# EAGLE design dlp.vco.dualosc.v1.1.main (EAGLE 7.2.0)
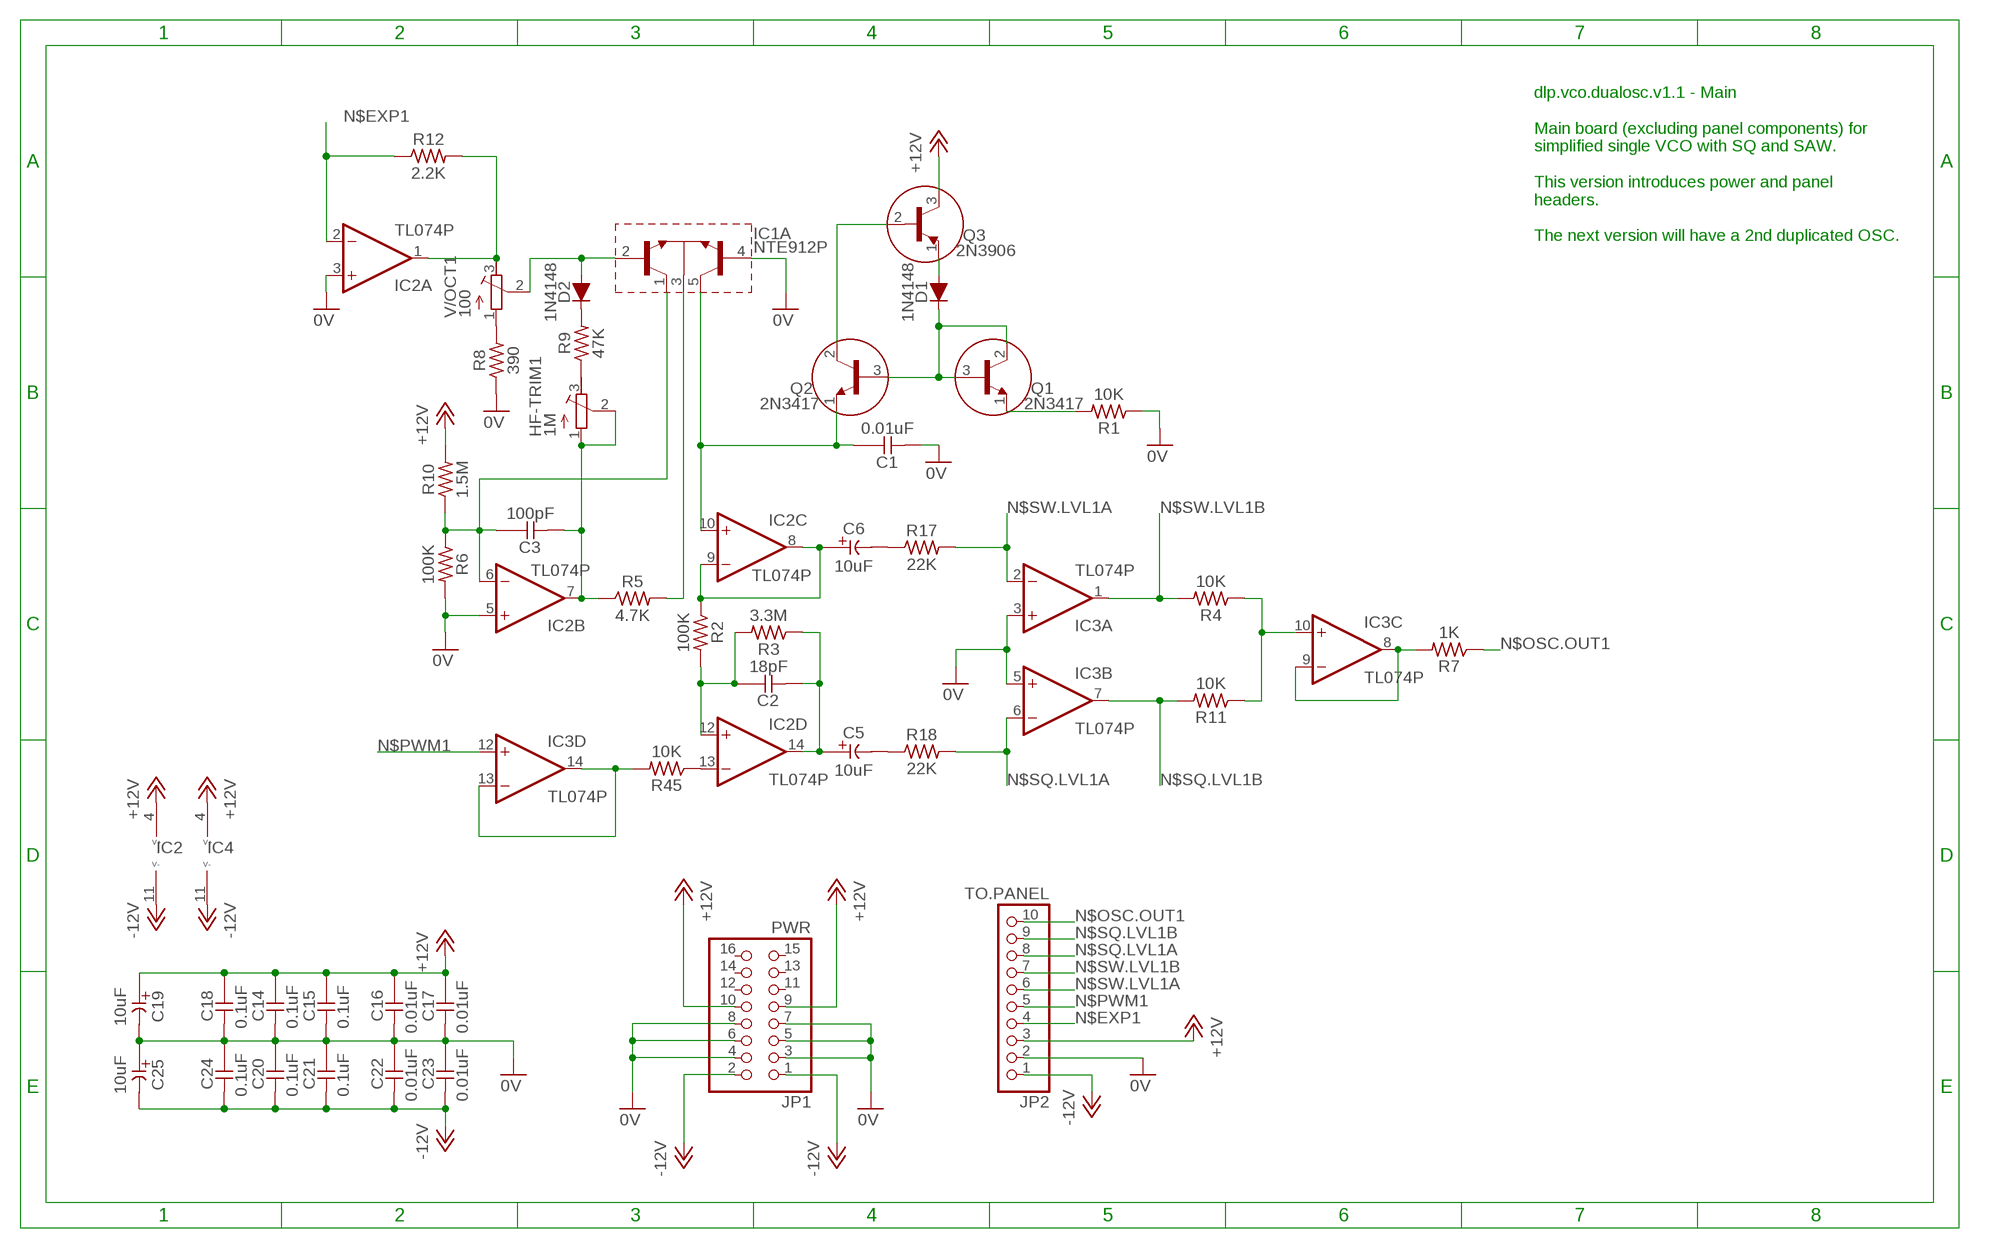
[diagram p0: schematic, sheet 1]

## Parts
C1  0.01uF  CC-US025-024X044  [C025-024X044]
C2  18pF  CC-US025-024X044  [C025-024X044]
C3  100pF  CC-US025-024X044  [C025-024X044]
C5  10uF  CE-USE2-5  [E2-5]
C6  10uF  CE-USE2-5  [E2-5]
C14  0.1uF  CC-US025-024X044  [C025-024X044]
C15  0.1uF  CC-US025-024X044  [C025-024X044]
C16  0.01uF  CC-US025-024X044  [C025-024X044]
C17  0.01uF  CC-US025-024X044  [C025-024X044]
C18  0.1uF  CC-US025-024X044  [C025-024X044]
C19  10uF  CE-USE2-5  [E2-5]
C20  0.1uF  CC-US025-024X044  [C025-024X044]
C21  0.1uF  CC-US025-024X044  [C025-024X044]
C22  0.01uF  CC-US025-024X044  [C025-024X044]
C23  0.01uF  CC-US025-024X044  [C025-024X044]
C24  0.1uF  CC-US025-024X044  [C025-024X044]
C25  10uF  CE-USE2-5  [E2-5]
D1  1N4148  [DO35-7]
D2  1N4148  [DO35-7]
HF-TRIM1  1M  R-TRIMM3296Y  [RTRIM3296Y]
IC1  NTE912P  [DIL14]
IC2  TL074P  [DIL14]
IC3  TL074P  [DIL14]
JP1  PWR  PINHD-2X8  [2X08]
JP2  TO.PANEL  PINHD-1X10  [1X10]
Q1  2N3417  [TO92]
Q2  2N3417  [TO92]
Q3  2N3906  [TO92]
R1  10K  R0309/10  [0309/10]
R2  100K  R0309/10  [0309/10]
R3  3.3M  R0309/10  [0309/10]
R4  10K  R0309/10  [0309/10]
R5  4.7K  R0309/10  [0309/10]
R6  100K  R0309/10  [0309/10]
R7  1K  R0309/10  [0309/10]
R8  390  R0309/10  [0309/10]
R9  47K  R0309/10  [0309/10]
R10  1.5M  R0309/10  [0309/10]
R11  10K  R0309/10  [0309/10]
R12  2.2K  R0309/10  [0309/10]
R17  22K  R0309/10  [0309/10]
R18  22K  R0309/10  [0309/10]
R45  10K  R0309/10  [0309/10]
V/OCT1  100  R-TRIMM3296Y  [RTRIM3296Y]

## Nets
0V: C1.2 C14.2 C15.2 C16.2 C17.2 C18.2 C19.- C20.1 C21.1 C22.1 C23.1 C24.1 C25.+ IC1.4(A:B3) IC2.3(A:+IN) IC2.5(B:+IN) IC3.3(A:+IN) IC3.5(B:+IN) JP1.3 JP1.4 JP1.5 JP1.6 JP1.7 JP1.8 JP2.2 R1.1 R6.2 R8.1
+12V: C14.1 C15.1 C16.1 C17.1 C18.1 C19.+ IC2.4(P:V+) IC3.4(P:V+) JP1.9 JP1.10 JP2.3 Q3.3(C) R10.2
-12V: C20.2 C21.2 C22.2 C23.2 C24.2 C25.- IC2.11(P:V-) IC3.11(P:V-) JP1.1 JP1.2 JP2.1
N$1: C1.1 IC1.5(A:C3) IC2.10(C:+IN) Q2.1(E)
N$2: Q2.2(C) Q3.2(B)
N$3: D1.A Q3.1(E)
N$4: C6.+ IC2.8(C:OUT) IC2.9(C:-IN) R2.1
N$5: D1.C Q1.2(C) Q1.3(B) Q2.3(B)
N$6: Q1.1(E) R1.2
N$7: C2.1 IC2.12(D:+IN) R2.2 R3.2
N$8: IC2.13(D:-IN) R45.1
N$9: C2.2 C5.+ IC2.14(D:OUT) R3.1
N$10: D2.A IC1.2(A:B1) V/OCT1.2(S)
N$12: IC1.3(A:E) R5.2
N$13: D2.C R9.2
N$14: R8.2 V/OCT1.1(A)
N$15: C3.1 IC1.1(A:C1) IC2.6(B:-IN) R6.1 R10.1
N$16: IC2.1(A:OUT) R12.2 V/OCT1.3(E)
N$17: HF-TRIM1.3(E) R9.1
N$18: IC3.10(C:+IN) R4.1 R11.1
N$20: IC3.8(C:OUT) IC3.9(C:-IN) R7.2
N$27: IC3.13(D:-IN) IC3.14(D:OUT) R45.2
N$29: C6.- R17.1
N$30: C5.- R18.1
N$37: C3.2 HF-TRIM1.1(A) HF-TRIM1.2(S) IC2.7(B:OUT) R5.1
N$EXP1: IC2.2(A:-IN) JP2.4 R12.1
N$OSC.OUT1: JP2.10 R7.1
N$PWM1: IC3.12(D:+IN) JP2.5
N$SQ.LVL1A: IC3.6(B:-IN) JP2.8 R18.2
N$SQ.LVL1B: IC3.7(B:OUT) JP2.9 R11.2
N$SW.LVL1A: IC3.2(A:-IN) JP2.6 R17.2
N$SW.LVL1B: IC3.1(A:OUT) JP2.7 R4.2
Unconnected: IC1.6(B:B) IC1.7(B:E) IC1.8(B:C) IC1.9(C:B) IC1.10(C:E) IC1.11(C:C) IC1.12(D:B) IC1.13(D:E) IC1.14(D:C) JP1.11 JP1.12 JP1.13 JP1.14 JP1.15 JP1.16

## Notes on the sheet
- dlp.vco.dualosc.v1.1 - Main
  
  Main board (excluding panel components) for 
  simplified single VCO with SQ and SAW.
  
  This version introduces power and panel 
  headers.
  
  The next version will have a 2nd duplicated OSC.
- IC2 | IC4

## Library data of the parts
C1-C3 C14-C18 C20-C24 = _common:CC-US: CAPACITOR, US symbol
C5 C6 C19 C25 = _common:CE-US: ELECTROLYTIC CAPACITOR, US symbol
D1 D2 = _common:1N4148: DIODE high speed (Philips)
HF-TRIM1 V/OCT1 = rcl:R-TRIMM: Trimm resistor
IC1 = _common:NTE912: NPN TRANSISTOR ARRAY
IC2 IC3 = _common:TL074: OP AMP
JP1 = pinhead:PINHD-2X8: PIN HEADER
JP2 = pinhead:PINHD-1X10: PIN HEADER
Q1 Q2 = _common:2N3417: NPN Transistor
Q3 = _common:2N3906: PNP Transistor
R1-R12 R17 R18 R45 = _common:R: RESISTOR, US symbol

## Board
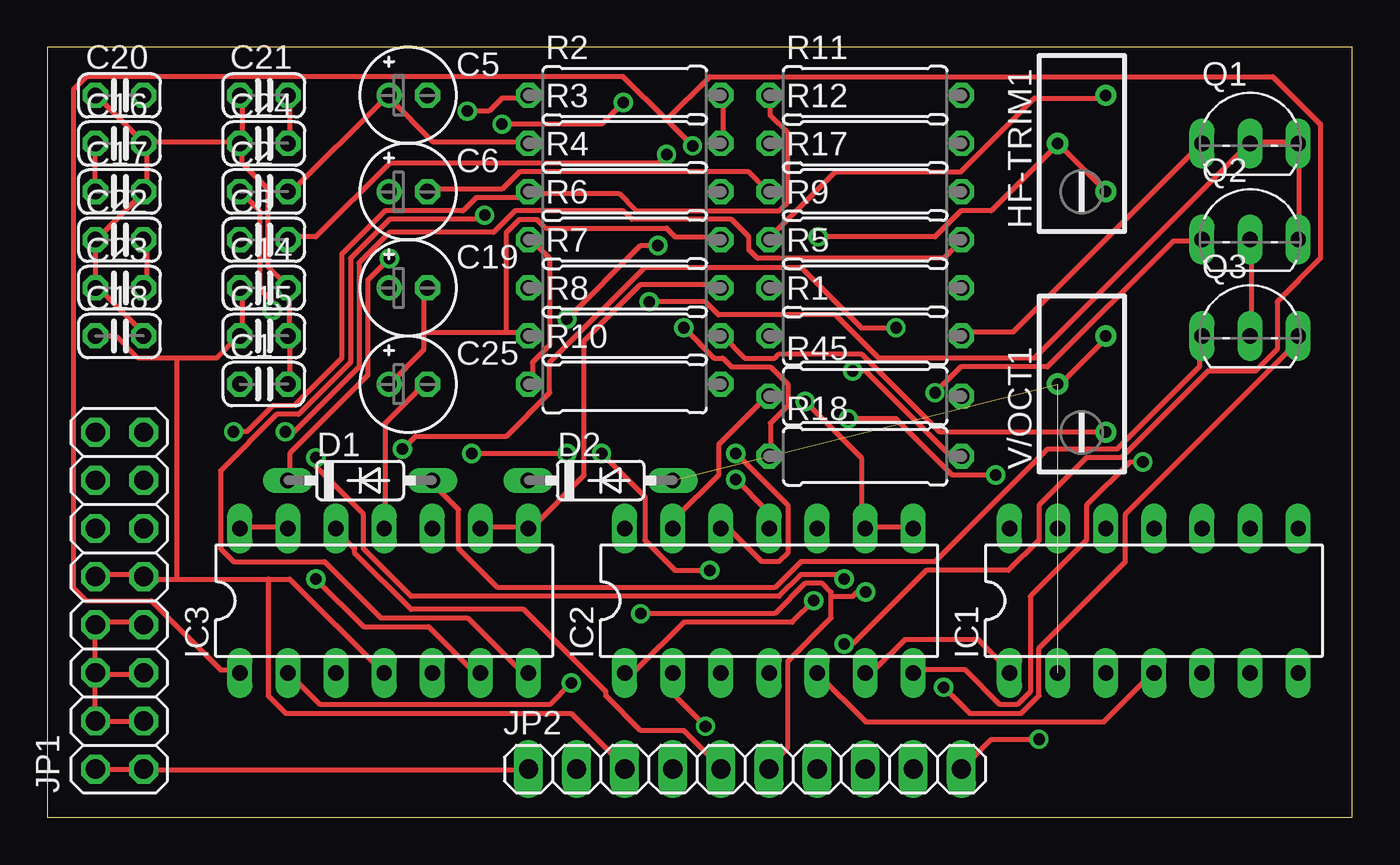
[diagram p1: board, top side]
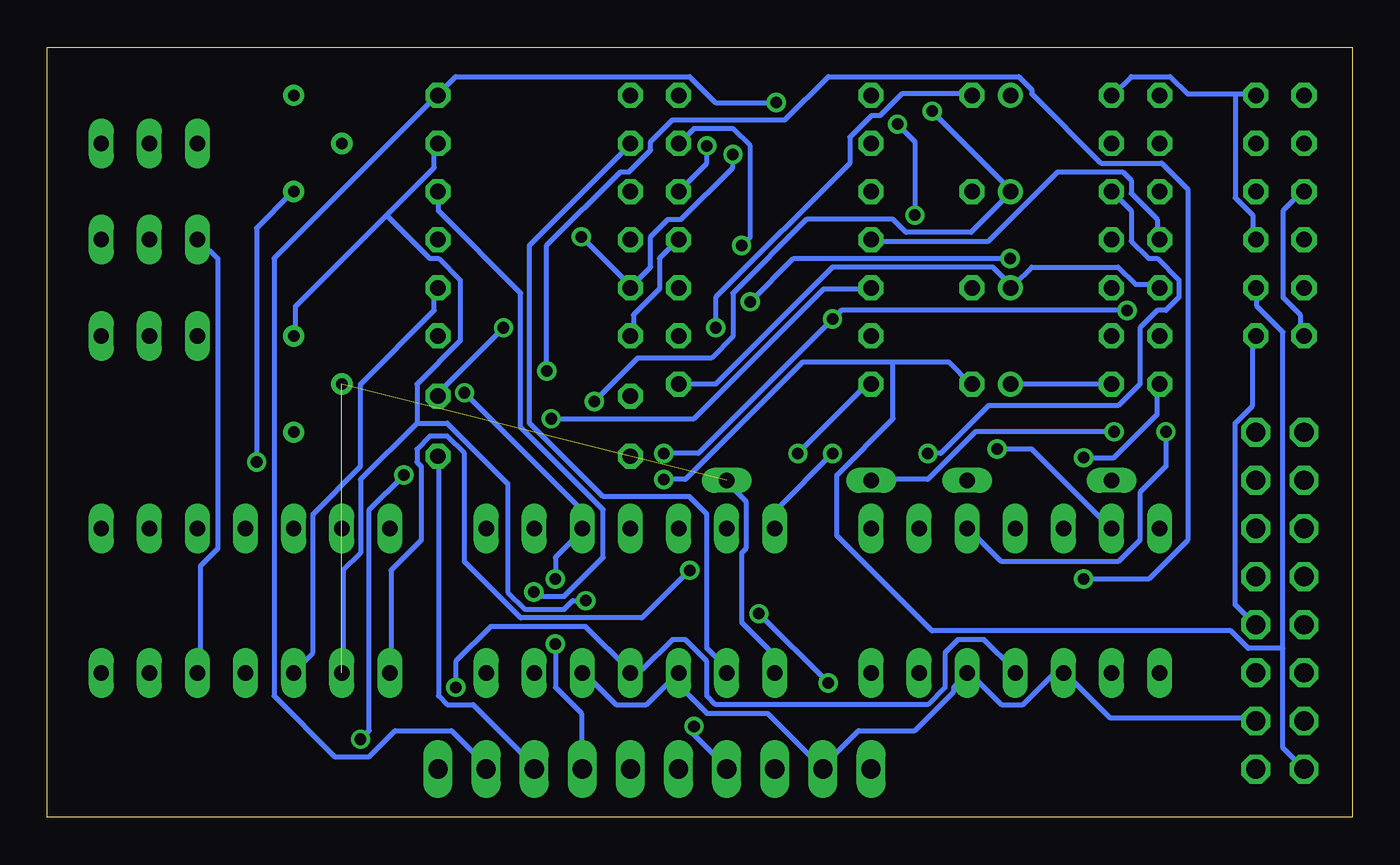
[diagram p2: board, bottom side, seen from below]

Size 68.89 x 40.63 mm. Coordinates in mm from the lower left corner, seen from the top.
Outline: 0,0 68.89,0 68.89,40.63 0,40.63 0,0
Copper layers (1*16): Top 0.035mm / dielectric 1.5mm / Bottom 0.035mm
Design rules "default": minimum track width 10mil, minimum drill 24mil, track to track 8mil, track to pad 8mil, pad to pad 8mil, via to via 8mil, smd to smd 8mil, copper to edge 40mil, drill to drill 8mil, minimum pad ring 10mil, minimum via ring 8mil, stop-mask expansion 4mil, vias tented up to drill 0mil, thermal gap 10mil

### Footprints (pad centres in the part's own frame; a part is rotated, then mirrored left to right if it is on the bottom)
C025-024X044 = drill 0.813 octagon: 1 -1.27,0; 2 1.27,0
E2-5 = drill 0.813 pad 1.27: + -1.016,0 | drill 0.813 pad 1.27 octagon: - 1.016,0
DO35-7 = drill 0.813 long: A 3.81,0; C -3.81,0
RTRIM3296Y = drill 0.61: 1 1.27,-2.54; 2 -1.27,0; 3 1.27,2.54
DIL14 = drill 0.813 long: 1 -7.62,-3.81; 2 -5.08,-3.81; 3 -2.54,-3.81; 4 0,-3.81; 5 2.54,-3.81; 6 5.08,-3.81; 7 7.62,-3.81; 8 7.62,3.81; 9 5.08,3.81; 10 2.54,3.81; 11 0,3.81; 12 -2.54,3.81; 13 -5.08,3.81; 14 -7.62,3.81
2X08 = drill 1.016 octagon: 1 -8.89,-1.27; 2 -8.89,1.27; 3 -6.35,-1.27; 4 -6.35,1.27; 5 -3.81,-1.27; 6 -3.81,1.27; 7 -1.27,-1.27; 8 -1.27,1.27; 9 1.27,-1.27; 10 1.27,1.27; 11 3.81,-1.27; 12 3.81,1.27; 13 6.35,-1.27; 14 6.35,1.27; 15 8.89,-1.27; 16 8.89,1.27
1X10 = drill 1.016 long: 1 -11.43,0; 2 -8.89,0; 3 -6.35,0; 4 -3.81,0; 5 -1.27,0; 6 1.27,0; 7 3.81,0; 8 6.35,0; 9 8.89,0; 10 11.43,0
TO92 = drill 0.813 long: 1 -2.54,-1.27; 2 0,-1.27; 3 2.54,-1.27
0309/10 = drill 0.813 octagon: 1 -5.08,0; 2 5.08,0

### Placement (x,y rotation side)
C1  11.43,22.86 0 top
C2  11.43,33.02 0 top
C3  11.43,30.48 0 top
C5  19.05,38.1 0 top
C6  19.05,33.02 0 top
C14  11.43,27.94 0 top
C15  11.43,25.4 0 top
C16  3.81,35.56 0 top
C17  3.81,33.02 0 top
C18  3.81,25.4 0 top
C19  19.05,27.94 0 top
C20  3.81,38.1 0 top
C21  11.43,38.1 0 top
C22  3.81,30.48 0 top
C23  3.81,27.94 0 top
C24  11.43,35.56 0 top
C25  19.05,22.86 0 top
D1  16.51,17.78 0 top
D2  29.21,17.78 0 top
HF-TRIM1  54.61,35.56 0 top
IC1  58.42,11.43 0 top
IC2  38.1,11.43 0 top
IC3  17.78,11.43 0 top
JP1  3.81,11.43 90 top
JP2  36.83,2.54 0 top
Q1  63.5,36.83 0 top
Q2  63.5,31.75 0 top
Q3  63.5,26.67 0 top
R1  43.18,25.4 0 top
R2  30.48,38.1 0 top
R3  30.48,35.56 0 top
R4  30.48,33.02 0 top
R5  43.18,27.94 0 top
R6  30.48,30.48 0 top
R7  30.48,27.94 0 top
R8  30.48,25.4 0 top
R9  43.18,30.48 0 top
R10  30.48,22.86 0 top
R11  43.18,38.1 0 top
R12  43.18,35.56 0 top
R17  43.18,33.02 0 top
R18  43.18,19.05 0 top
R45  43.18,22.23 0 top
V/OCT1  54.61,22.86 0 top

### Tracks (layer width: path | path; a pad name or v marks a point on that pad's centre or on a via)
0V
  Top 0.254: C18.2 5.03,25.6 2.74,27.89 C23.1 2.52,28.12 2.52,30.4 C22.1 2.74,30.63 5.03,32.92 C17.2 5.26,33.15 5.26,35.43 C16.2 | C24.1 10.29,35.66 10.29,37.95 C21.1 | C20.1 2.74,37.95 5.03,35.66 C16.2 | C24.1 10.06,35.66 5.26,35.66 C16.2 | C1.2 12.8,22.86 12.8,25.38 C15.2 12.8,25.6 12.8,27.89 C14.2 12.57,28.12 11.66,29.03 11.66,33.15 10.29,34.52 10.29,35.43 C24.1 | 19.89,25.6 19.89,24.69 18.06,22.86 C25.+ | 19.89,25.6 19.89,27.89 C19.- | 19.89,25.6 24.23,25.6 | 24.23,25.6 25.38,25.6 R8.1 | 24.23,25.6 24.23,30.86 24.92,31.55 25.83,31.55 26.29,31.09 32.69,31.09 33.15,30.63 35.43,30.63 R6.2 | JP1.7 5.03,10.29 2.74,10.29 JP1.8 2.52,10.06 2.52,7.77 JP1.6 | JP1.3 5.03,5.03 2.74,5.03 JP1.4 2.52,5.26 2.52,7.54 JP1.6 | JP1.5 5.03,7.54 2.74,7.54 JP1.6 | IC1.4 58.29,7.54 55.78,5.03 43.2,5.03 40.69,7.54 IC2.5
  Bottom 0.254: R1.1 37.95,25.6 37.95,26.52 36.58,27.89 36.58,29.49 35.66,30.4 R6.2 | C1.2 C25.+ | 35.89,7.32 37.26,5.94 38.86,5.94 40.46,7.54 IC2.5 | 35.89,7.32 35.66,7.54 IC2.3 35.89,7.32 | 35.89,7.32 34.06,5.49 30.86,5.49 28.12,2.74 JP2.2 27.89,2.74 26.06,4.57 23.09,4.57 21.03,6.63 21.03,6.86 20.34,7.54 IC3.5 20.12,7.54 18.52,5.94 17.37,5.94 15.77,7.54 15.32,7.54 IC3.3 15.09,7.54 12.8,5.26 5.26,5.26 JP1.3 | C18.2 5.26,25.38 5.26,21.72 6.17,20.8 6.17,11.2 5.26,10.29 JP1.7
+12V  (via drill 0.61)
  Top 0.254: C16.1 2.52,35.43 2.52,33.15 C17.1 | C14.1 10.29,27.89 10.29,25.6 C15.1 10.06,25.38 8.91,24.23 6.86,24.23 | 6.86,24.23 4.8,24.23 3.66,25.38 2.74,25.38 C18.1 | 6.86,12.57 5.26,12.57 JP1.9 5.03,12.8 2.74,12.8 JP1.10 | 6.86,12.57 11.66,12.57 | 11.66,12.57 12.8,12.57 17.6,7.77 IC3.4 | v47.32,6.86 48.69,5.49 51.44,5.49 52.35,6.4 52.35,8.91 56.92,13.49 56.92,16 65.84,24.92 65.84,25.38 Q3.3 | 11.66,12.57 11.66,6.4 12.57,5.49 27.66,5.49 30.4,2.74 JP2.3 | 6.86,12.57 6.86,24.23
  Bottom 0.254: C18.1 2.74,25.6 2.74,26.52 3.66,27.43 3.66,32 2.74,32.92 C17.1 | R10.2 33.6,22.86 27.43,29.03 18.97,29.03 18.06,28.12 C19.+ 17.83,28.12 16.92,29.03 12.34,29.03 11.43,28.12 10.29,28.12 C14.1 | IC3.4 17.83,7.77 19.43,9.37 20.8,9.37 21.49,8.69 21.49,6.86 22.4,5.94 33.6,5.94 34.06,6.4 34.06,8.23 35.2,9.37 35.89,9.37 37.49,7.77 37.95,7.77 IC2.4 38.18,7.77 40.46,10.06 45.49,10.06 47.32,8.23 v47.32,6.86
-12V  (via drill 0.61)
  Top 0.254: IC3.11 17.83,15.32 17.83,20.8 19.89,22.86 C25.- | v36.35,17.83 37.95,16.23 37.95,15.32 IC2.11 | C23.2 5.26,28.12 5.26,30.4 C22.2 | C24.2 12.8,35.66 12.8,37.95 C21.2 | JP1.2 2.74,2.52 5.03,2.52 JP1.1 5.26,2.52 25.38,2.52 JP2.1
  Bottom 0.254: v36.35,17.83 35.2,17.83 29.03,24 24.23,24 | 24.23,24 21.26,24 20.12,22.86 C25.- | 6.17,38.18 8.69,38.18 9.6,39.09 11.66,39.09 12.57,38.18 C21.2 | 6.17,38.18 5.26,38.18 C20.2 | 6.17,38.18 6.17,32.69 5.26,31.77 5.26,30.63 C22.2 | 3.66,8.91 3.66,3.66 JP1.2 | 3.66,8.91 3.66,25.6 5.03,26.98 5.03,27.89 C23.2 | 24.23,24 24.23,21.03 27.2,18.06 27.2,14.86 22.17,9.83 6.4,9.83 5.49,8.91 3.66,8.91
N$1  (via drill 0.61)
  Top 0.254: v46.86,22.4 48.23,23.77 52.81,23.77 59.44,30.4 60.81,30.4 Q2.1 | v14.17,18.97 14.17,18.52 16.69,16 16.69,14.17 19.2,11.66 38.63,11.66 39.78,12.8 41.83,12.8 v42.06,12.57
  Bottom 0.254: v46.86,22.4 40.69,16.23 40.69,15.32 IC2.10 40.69,15.09 42.06,13.72 v42.06,12.57 | v14.17,18.97 12.57,18.97 10.29,21.26 10.29,22.86 C1.1 | IC1.5 60.81,7.77 60.81,13.26 59.89,14.17 59.89,29.49 60.81,30.4 Q2.1
N$2
  Top 0.254: Q3.2 63.55,25.6 63.55,30.4 Q2.2
N$3
  Top 0.254: D1.A 20.34,17.6 21.72,16.23 21.72,14.17 23.77,12.12 38.41,12.12 39.78,13.49 46.86,13.49 52.81,19.43 56.46,19.43 60.81,23.77 60.81,25.38 Q3.1
N$4  (via drill 0.61)
  Top 0.254: IC2.8 45.72,15.32 43.2,15.32 IC2.9 42.98,15.32 42.98,18.97 v40.01,21.95 | v22.17,37.26 23.32,37.26 24,37.95 25.38,37.95 R2.1
  Bottom 0.254: v22.17,37.26 18.06,33.15 C6.+ 18.06,32.92 20.12,30.86 23.55,30.86 24.23,31.55 28.8,31.55 32.69,27.66 32.69,25.38 33.83,24.23 37.72,24.23 v40.01,21.95
N$5  (via drill 0.61)
  Top 0.254: Q2.3 66.06,30.63 66.06,35.43 Q1.3 65.84,35.66 63.55,35.66 Q1.2 63.32,35.43 52.12,24.23 43.89,24.23 41.6,26.52 35.43,26.52 34.75,27.2 v31.77,27.2 | v18.06,29.49 16.92,28.35 16.92,23.32 12.8,19.2 12.8,17.83 D1.C
  Bottom 0.254: v18.06,29.49 29.49,29.49 v31.77,27.2
N$6
  Top 0.254: R1.2 48.46,25.6 50.98,25.6 60.81,35.43 Q1.1
N$7  (via drill 0.61)
  Top 0.254: R3.2 35.66,35.66 35.66,37.95 R2.2 | v36.35,19.2 39.09,16.46 39.09,13.95 38.63,13.49 37.72,13.49 36.12,15.09 35.66,15.09 IC2.12 | v11.89,26.75 11.89,27.2 11.2,27.89 11.2,32 10.29,32.92 C2.1 | v32.23,30.18 31.32,30.18 v27.43,26.29
  Bottom 0.254: v36.35,19.2 34.52,19.2 v27.43,26.29 26.98,26.75 v11.89,26.75 | v32.23,30.18 31.77,30.63 31.77,35.43 32.69,36.35 34.75,36.35 35.43,35.66 R3.2
N$8
  Top 0.254: IC2.13 33.15,15.32 33.15,15.77 35.43,18.06 35.43,19.66 37.95,22.17 R45.1
N$9  (via drill 0.61)
  Top 0.254: v22.4,19.2 v27.43,19.2 | C2.2 12.8,32.92 17.83,37.95 C5.+ 18.06,37.95 20.34,35.66 25.38,35.66 R3.1
  Bottom 0.254: v27.43,19.2 30.4,16.23 30.4,15.32 IC2.14 | v22.4,19.2 21.72,19.2 19.2,21.72 12.34,21.72 11.2,22.86 11.2,25.83 10.29,26.75 9.83,26.75 9.14,27.43 9.14,28.35 10.29,29.49 10.74,29.49 11.66,30.4 11.66,32 12.57,32.92 C2.2
N$10  (2 unrouted)
N$12
  Bottom 0.254: R5.2 48.46,27.89 48.46,26.75 52.35,22.86 52.35,18.52 54.86,16 54.86,8.69 55.78,7.77 IC1.3
N$13  (via drill 0.61)
  Top 0.254: v12.57,20.34 13.03,20.34 16.46,23.77 16.46,29.26 18.06,30.86 23.55,30.86 24.69,32 30.4,32 30.86,31.55 36.12,31.55 37.03,30.63 37.03,29.95 37.49,29.49 47.32,29.49 48.23,30.4 R9.2
  Bottom 0.254: v12.57,20.34 19.89,20.34 22.4,17.83 25.38,17.83 D2.C
N$14
  Top 0.254: V/OCT1.1 55.78,20.34 47.09,20.34 42.98,24.46 38.63,24.46 38.41,24.23 36.8,24.23 35.66,25.38 R8.2
N$15  (via drill 0.61)
  Top 0.254: IC2.6 43.2,7.77 43.66,7.77 45.26,9.37 49.15,9.37 50.75,7.77 IC1.1 | R10.1 25.6,22.86 25.6,24 26.52,24.92 26.52,29.49 25.6,30.4 R6.1 | v34.98,13.03 33.15,13.03 31.55,14.63 31.55,16.92 v29.26,19.2
  Bottom 0.254: C3.1 10.29,30.63 10.29,31.55 11.66,32.92 11.66,33.6 12.12,34.06 15.54,34.06 19.2,30.4 25.38,30.4 R6.1 | v34.98,13.03 37.49,10.52 43.89,10.52 46.86,13.49 46.86,19.2 47.78,20.12 48.69,20.12 49.38,19.43 49.38,18.75 49.15,18.52 49.15,14.63 50.75,13.03 50.75,7.77 IC1.1 | v29.26,19.2 25.6,22.86 R10.1
N$16  (via drill 0.61)
  Top 0.254: 53.49,22.86 56.01,25.38 V/OCT1.3 | v40.46,11.43 39.32,10.29 33.6,10.29 31.09,7.77 30.63,7.77 IC2.1
  Bottom 0.254: 32.92,17.6 32,16.69 32,14.17 32.23,13.95 32.23,10.29 30.63,8.69 30.63,7.77 IC2.1 | 50.98,31.77 55.78,26.98 55.78,25.6 V/OCT1.3 | 50.98,31.77 48.46,34.29 48.46,35.43 R12.2 | 53.26,7.77 53.26,13.03 52.35,13.95 52.35,17.83 49.38,20.8 | 49.38,20.8 49.38,22.86 47.09,25.15 47.09,28.35 48.23,29.49 48.69,29.49 50.98,31.77 | v40.46,11.43 41.15,11.43 41.6,10.97 43.66,10.97 44.58,11.89 44.58,17.6 47.78,20.8 49.38,20.8
N$17
  Top 0.254: HF-TRIM1.3 55.78,37.95 52.12,37.95 48.23,34.06 41.6,34.06 38.18,30.63 R9.1
N$18  (via drill 0.61)
  Top 0.254: v9.83,20.34 10.52,20.34 11.89,21.72 13.03,21.72 15.54,24.23 15.54,29.72 17.83,32 21.95,32 22.63,32.69 25.15,32.69 25.38,32.92 R4.1 25.6,32.92 30.18,32.92 31.09,32 38.63,32 39.09,32.46 39.09,36.12 38.18,37.03 38.18,37.95 R11.1
  Bottom 0.254: v9.83,20.34 9.83,18.52 11.2,17.14 11.2,14.63 12.34,13.49 18.52,13.49 20.12,15.09 IC3.10
N$20
  Top 0.254: IC3.9 22.86,15.32 25.38,15.32 IC3.8 25.6,15.32 28.35,18.06 28.35,25.15 31.32,28.12 35.43,28.12 R7.2
N$27  (via drill 0.61)
  Top 0.254: IC3.14 10.29,15.32 12.57,15.32 IC3.13 | v44.81,25.83 42.98,25.83 39.78,29.03 31.55,29.03 26.52,24 26.52,22.4 24.23,20.12 19.43,20.12 v18.75,19.43
  Bottom 0.254: v44.81,25.83 48.23,22.4 R45.2 | v18.75,19.43 16.92,19.43 12.8,15.32 IC3.13
N$29
  Top 0.254: C6.- 20.12,33.15 24,33.15 24.92,34.06 37.03,34.06 37.95,33.15 R17.1
N$30  (via drill 0.61)
  Top 0.254: v33.6,25.83 35.2,24.23 35.66,24.23 36.12,23.77 38.18,23.77 39.09,22.86 39.09,21.72 38.18,20.8 38.18,19.2 R18.1
  Bottom 0.254: v33.6,25.83 33.6,27.43 26.52,34.52 26.52,35.89 25.38,37.03 24.92,37.03 23.77,38.18 20.12,38.18 C5.-
N$37  (via drill 0.61)
  Top 0.254: HF-TRIM1.1 55.78,33.15 53.49,35.43 HF-TRIM1.2 53.26,35.43 49.84,32 48.23,32 46.86,30.63 v40.69,30.63 | v57.84,18.75 57.15,18.75 54.86,16.46 54.86,14.63 51.89,11.66 51.89,6.63 51.21,5.94 50.29,5.94 48.46,7.77 45.72,7.77 IC2.7 | v32.69,34.98 32.23,34.52 18.06,34.52 14.17,30.63 12.8,30.63 C3.2
  Bottom 0.254: v57.84,18.75 57.84,31.09 56.01,32.92 HF-TRIM1.1 | v40.69,30.63 38.18,28.12 R5.1 37.95,28.12 37.03,29.03 37.03,30.63 36.12,31.55 35.43,31.55 32.69,34.29 v32.69,34.98
N$EXP1  (via drill 0.61)
  Top 0.254: v34.75,4.8 33.15,6.4 33.15,7.54 IC2.2
  Bottom 0.254: v34.75,4.8 34.75,4.34 33.15,2.74 JP2.4 | R12.1 38.18,35.43 43.43,30.18 43.43,20.8 39.55,16.92 34.98,16.92 34.06,16 34.06,8.91 32.92,7.77 IC2.2
N$OSC.OUT1  (via drill 0.61)
  Top 0.254: v42.29,21.03 44.81,21.03 47.78,18.06 v50.06,18.06 | v52.35,4.12 49.84,4.12 JP2.10
  Bottom 0.254: v42.29,21.03 34.75,21.03 27.89,27.89 25.6,27.89 R7.1 | v50.06,18.06 51.89,16.23 51.89,4.57 v52.35,4.12
N$PWM1
  Top 0.254: IC3.12 15.32,15.09 16.23,14.17 16.23,13.95 19.2,10.97 25.15,10.97 29.49,6.63 29.49,6.4 31.32,4.57 33.6,4.57 35.43,2.74 JP2.5
N$SQ.LVL1A  (via drill 0.61)
  Top 0.254: v14.17,12.57 16.69,10.06 20.12,10.06 22.4,7.77 22.86,7.77 IC3.6 | v42.52,23.55 43.2,23.55 47.55,19.2 48.23,19.2 R18.2
  Bottom 0.254: v14.17,12.57 10.74,12.57 8.69,14.63 8.69,33.15 10.06,34.52 13.26,34.52 16.92,38.18 16.92,38.41 17.6,39.09 27.66,39.09 29.95,36.8 35.89,36.8 37.03,35.66 37.03,35.2 38.18,34.06 38.63,34.06 42.52,30.18 v42.52,23.55 | JP2.8 43.2,2.74 46.41,5.94 47.78,5.94 48.23,6.4 48.23,18.97 R18.2
N$SQ.LVL1B  (via drill 0.61)
  Top 0.254: v23.09,31.77 22.86,31.55 18.06,31.55 16,29.49 16,24 13.26,21.26 12.12,21.26 9.14,18.29 9.14,14.17 9.83,13.49 14.63,13.49 17.6,10.52 22.17,10.52 24.92,7.77 25.38,7.77 IC3.7 | v24,36.58 29.26,36.58 v30.4,37.72
  Bottom 0.254: v23.09,31.77 23.09,35.66 v24,36.58 | v30.4,37.72 33.6,37.72 34.98,39.09 47.32,39.09 48.23,38.18 R11.2 48.46,37.95 56.92,29.49 56.92,6.4 53.72,3.2 51.89,3.2 50.52,4.57 47.55,4.57 45.72,2.74 JP2.9
N$SW.LVL1A  (via drill 0.61)
  Top 0.254: v27.66,7.09 26.52,5.94 14.4,5.94 12.8,7.54 IC3.2 | v31.32,10.74 38.41,10.74 40.01,12.34 40.92,12.34 41.38,11.89 41.38,11.66 | 41.38,11.66 41.38,10.52 39.09,8.23 39.09,3.66 38.18,2.74 JP2.6 | v43.2,11.89 42.75,11.89 42.52,11.66 41.38,11.66
  Bottom 0.254: v31.32,10.74 v27.66,7.09 | v43.2,11.89 42.98,11.66 41.6,11.66 39.55,13.72 39.55,16.23 43.89,20.57 43.89,27.66 48.23,32 48.23,32.92 R17.2
N$SW.LVL1B  (via drill 0.61)
  Top 0.254: v34.06,35.43 32.69,36.8 | 32.69,36.8 30.4,39.09 2.06,39.09 1.37,38.41 1.37,12.12 2.06,11.43 5.49,11.43 9.14,7.77 10.06,7.77 IC3.1 | v42.06,9.14 42.52,9.14 46.41,13.03 50.75,13.03 52.35,14.63 52.35,16.46 54.86,18.97 56.69,18.97 61.27,23.55 63.78,23.55 64.92,24.69 64.92,27.2 67.21,29.49 67.21,36.58 64.69,39.09 34.98,39.09 32.69,36.8
  Bottom 0.254: v34.06,35.43 34.06,34.52 R4.2 | v42.06,9.14 42.06,6.86 40.69,5.49 40.69,2.74 JP2.7